# EAGLE design EspSwitchNode (EAGLE 7.2.0)
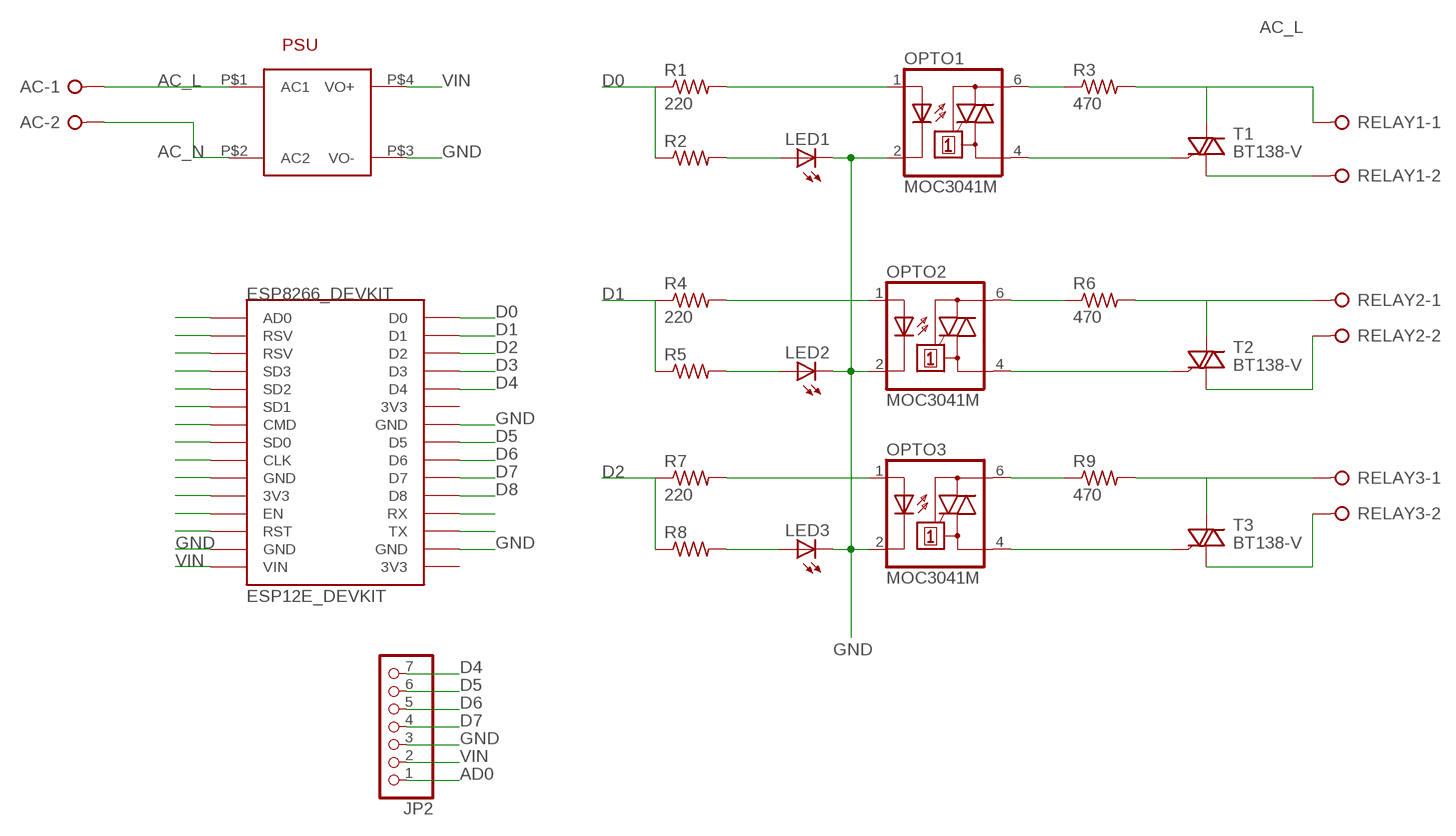
[diagram p0: schematic, sheet 1]

## Parts
AC  W237-02P  [W237-132]
ESP8266_DEVKIT  ESP12E_DEVKIT  [ESP12E_DEVKIT]
JP2  PINHD-1X7  [1X07]
LED1  LEDCHIPLED_0805  [CHIPLED_0805]
LED2  LEDCHIPLED_0805  [CHIPLED_0805]
LED3  LEDCHIPLED_0805  [CHIPLED_0805]
OPTO1  MOC3041M  [DIL06]
OPTO2  MOC3041M  [DIL06]
OPTO3  MOC3041M  [DIL06]
PSU  HLK-PM01  [HLK-PM01]
R1  220  R-US_M0805  [M0805]
R2  R-US_M0805  [M0805]
R3  470  R-US_M0805  [M0805]
R4  220  R-US_M0805  [M0805]
R5  R-US_M0805  [M0805]
R6  470  R-US_M0805  [M0805]
R7  220  R-US_M0805  [M0805]
R8  R-US_M0805  [M0805]
R9  470  R-US_M0805  [M0805]
RELAY1  W237-02P  [W237-132]
RELAY2  W237-02P  [W237-132]
RELAY3  W237-02P  [W237-132]
T1  BT138-V  [TO220BV]
T2  BT138-V  [TO220BV]
T3  BT138-V  [TO220BV]

## Nets
3V3: ESP8266_DEVKIT.3V3@0(3V3)
AC_L: AC.1 PSU.P$1(AC1) R3.2 R6.2 R9.2 RELAY1.1 RELAY2.1 RELAY3.1 T1.T2(A2) T2.T2(A2) T3.T2(A2)
AC_N: AC.2 PSU.P$2(AC2)
AD0: ESP8266_DEVKIT.AD0 JP2.1
CLK: ESP8266_DEVKIT.CLK
CMD: ESP8266_DEVKIT.CMD
D0: ESP8266_DEVKIT.D0 R1.1 R2.1
D1: ESP8266_DEVKIT.D1 R4.1 R5.1
D2: ESP8266_DEVKIT.D2 R7.1 R8.1
D3: ESP8266_DEVKIT.D3
D4: ESP8266_DEVKIT.D4 JP2.7
D5: ESP8266_DEVKIT.D5 JP2.6
D6: ESP8266_DEVKIT.D6 JP2.5
D7: ESP8266_DEVKIT.D7 JP2.4
D8: ESP8266_DEVKIT.D8
EN: ESP8266_DEVKIT.EN
GND: ESP8266_DEVKIT.GND@0(GND) ESP8266_DEVKIT.GND@1(GND) ESP8266_DEVKIT.GND@2(GND) ESP8266_DEVKIT.GND@3(GND) JP2.3 LED1.C LED2.C LED3.C OPTO1.2(C) OPTO2.2(C) OPTO3.2(C) PSU.P$3(VO-)
N$1: OPTO1.1(A) R1.2
N$2: ESP8266_DEVKIT.RSV@0(RSV)
N$3: ESP8266_DEVKIT.RSV@1(RSV)
N$4: OPTO1.6(A2) R3.1
N$6: OPTO2.1(A) R4.2
N$7: LED2.A R5.2
N$9: OPTO2.6(A2) R6.1
N$10: OPTO1.4(A1) T1.G
N$11: OPTO2.4(A1) T2.G
N$12: OPTO3.1(A) R7.2
N$13: LED3.A R8.2
N$14: RELAY2.2 T2.T1(A1)
N$15: OPTO3.6(A2) R9.1
N$16: OPTO3.4(A1) T3.G
N$17: RELAY3.2 T3.T1(A1)
N$18: LED1.A R2.2
N$19: RELAY1.2 T1.T1(A1)
RST: ESP8266_DEVKIT.RST
RX: ESP8266_DEVKIT.RX
SD0: ESP8266_DEVKIT.SD0
SD1: ESP8266_DEVKIT.SD1
SD2: ESP8266_DEVKIT.SD2
SD3: ESP8266_DEVKIT.SD3
TX: ESP8266_DEVKIT.TX
VIN: ESP8266_DEVKIT.VIN JP2.2 PSU.P$4(VO+)
Unconnected: ESP8266_DEVKIT.3V3@1(3V3) ESP8266_DEVKIT.3V3@2(3V3)

## Library data of the parts
AC RELAY1-RELAY3 = con-wago-508:W237-02P: WAGO SREW CLAMP; OC_FARNELL: unknown; OC_NEWARK: unknown
ESP8266_DEVKIT = ESP12E_DEVKIT:ESP12E_DEVKIT: ESP12E DEVKIT BOARD
JP2 = pinhead:PINHD-1X7: PIN HEADER
LED1-LED3 = adafruit:LED: LED OSRAM: - CHIPLED LG R971, LG N971, LY N971, LG Q971, LY Q971, LO R971, LY R971 LH N974, LH R974 LS Q976, LO Q976, LY Q976 LO Q996 - Hyper CHIPLED LW Q18S LB Q993, LB Q99A, LB R99A - SideLED LS A670, LO A670, LY A670, LG A670, LP A670 LB A673, LV A673, LT A673, LW A673 LH A674 LY A675 LS A676, LA A676, LO A676, LY A676, LW A676 LS A679, LY A679, LG A679 - Hyper Micro SIDELED® LS Y876, LA Y876, LO Y876, LY Y876 LT Y87S - SmartLED LW L88C, LW L88S LB L89C, LB L89S, LG L890 LS L89K, LO L89K, LY L89K LS L896, LA L896, LO L896, LY L896 - TOPLED LS T670, LO T670, LY T670, LG T670, LP T670 LSG T670, LSP T670, LSY T670, LOP T670, LYG T670 LG T671, LOG T671, LSG T671 LB T673, LV T673, LT T673, LW T673 LH T674 LS T676, LA T676, LO T676, LY T676, LB T676, LH T676, LSB T676, LW T676 LB T67C, LV T67C, LT T67C, LS T67K, LO T67K, LY T67K, LW E67C LS E67B, LA E67B, LO E67B, LY E67B, LB E67C, LV E67C, LT E67C LW T67C LS T679, LY T679, LG T679 LS T770, LO T770, LY T770, LG T770, LP T770 LB T773, LV T773, LT T773, LW T773 LH T774 LS E675, LA E675, LY E675, LS T675 LS T776, LA T776, LO T776, LY T776, LB T776 LHGB T686 LT T68C, LB T68C - Hyper Mini TOPLED® LB M676 - Mini TOPLED Santana® LG M470 LS M47K, LO M47K, LY M47K Source: http://www.osram.convergy.de/
OPTO1-OPTO3 = optocoupler:MOC30*: 6-Pin DIP Zero-Cross Optoisolators Triac Driver Output (250/400 Volt Peak) Source: Data sheet <http://www.fairchildsemi.com/ds/MO/MOC3031M.pdf> The old path of data sheet not more available 2013-05-06.; MF: FAIRCHILD SEMICONDUCTOR; MPN: MOC3041M; OC_FARNELL: 1086677; OC_NEWARK: 78K6090
PSU = HLK-PM01-Exported:HLK-PM01: HI-LINK Ultra-compact power module HLK-PM01 Meet UL, CE requirements Ultra-thin, ultra-small All voltage input (AC: 90 ~ 264V) Low ripple and low noise Output overload and short circuit protection High efficiency, high power density The product is designed to meet the requirements of EMC and Safety Test Low power consumption, environmental protection, no-load loss <0.1W 100% load aging and testing
R1-R9 = resistor:R-US_: RESISTOR, American symbol
T1-T3 = triac:BT138: TRIAC Source: http://www.semiconductors.philips.com BT138_SERIES_2.pdf

## Board
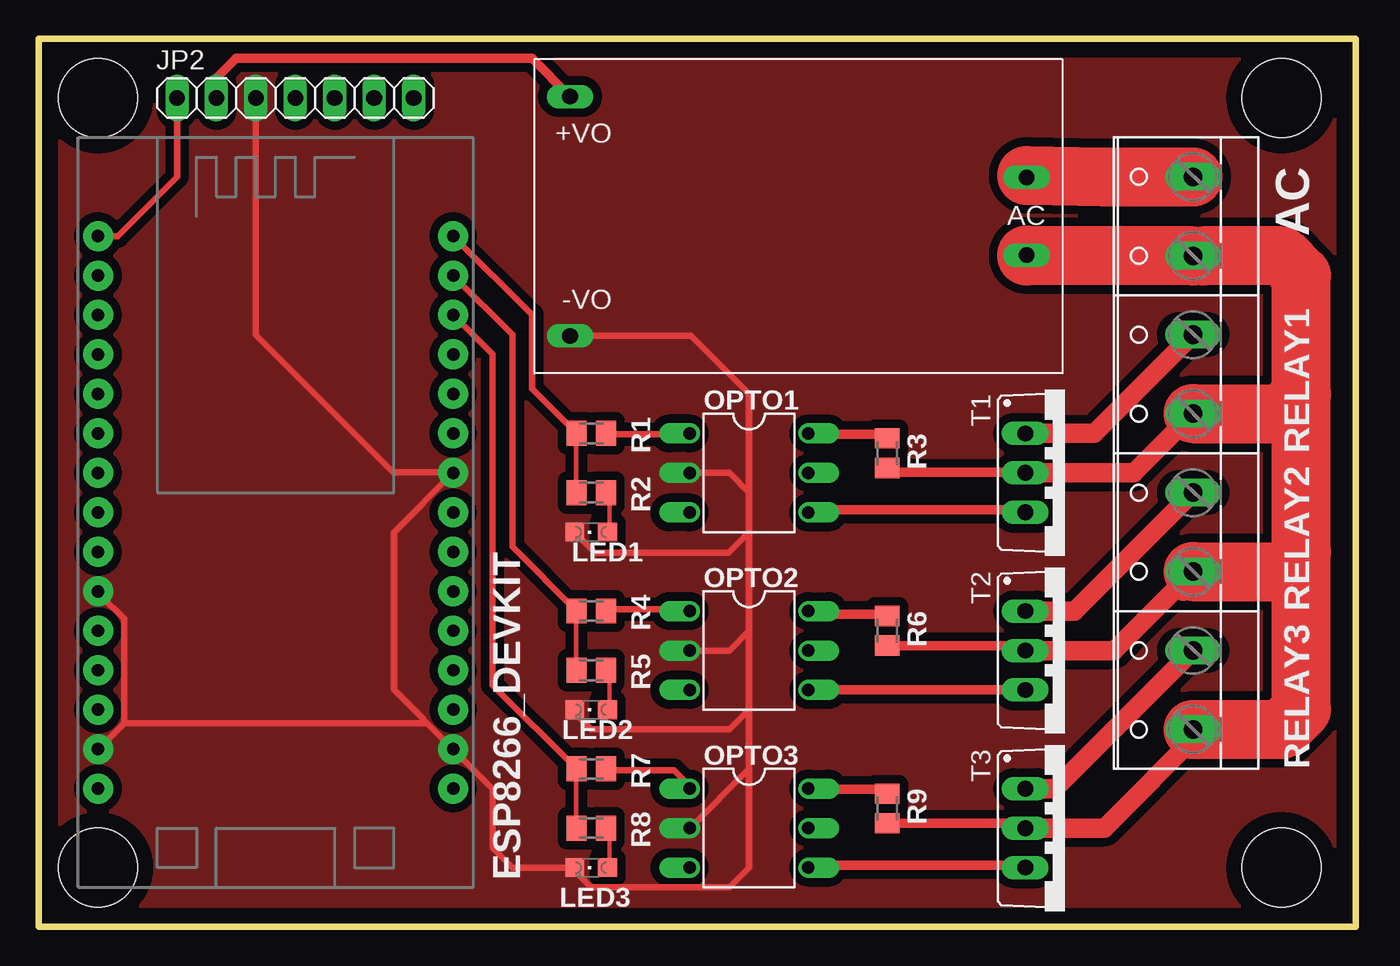
[diagram p1: board, top side]
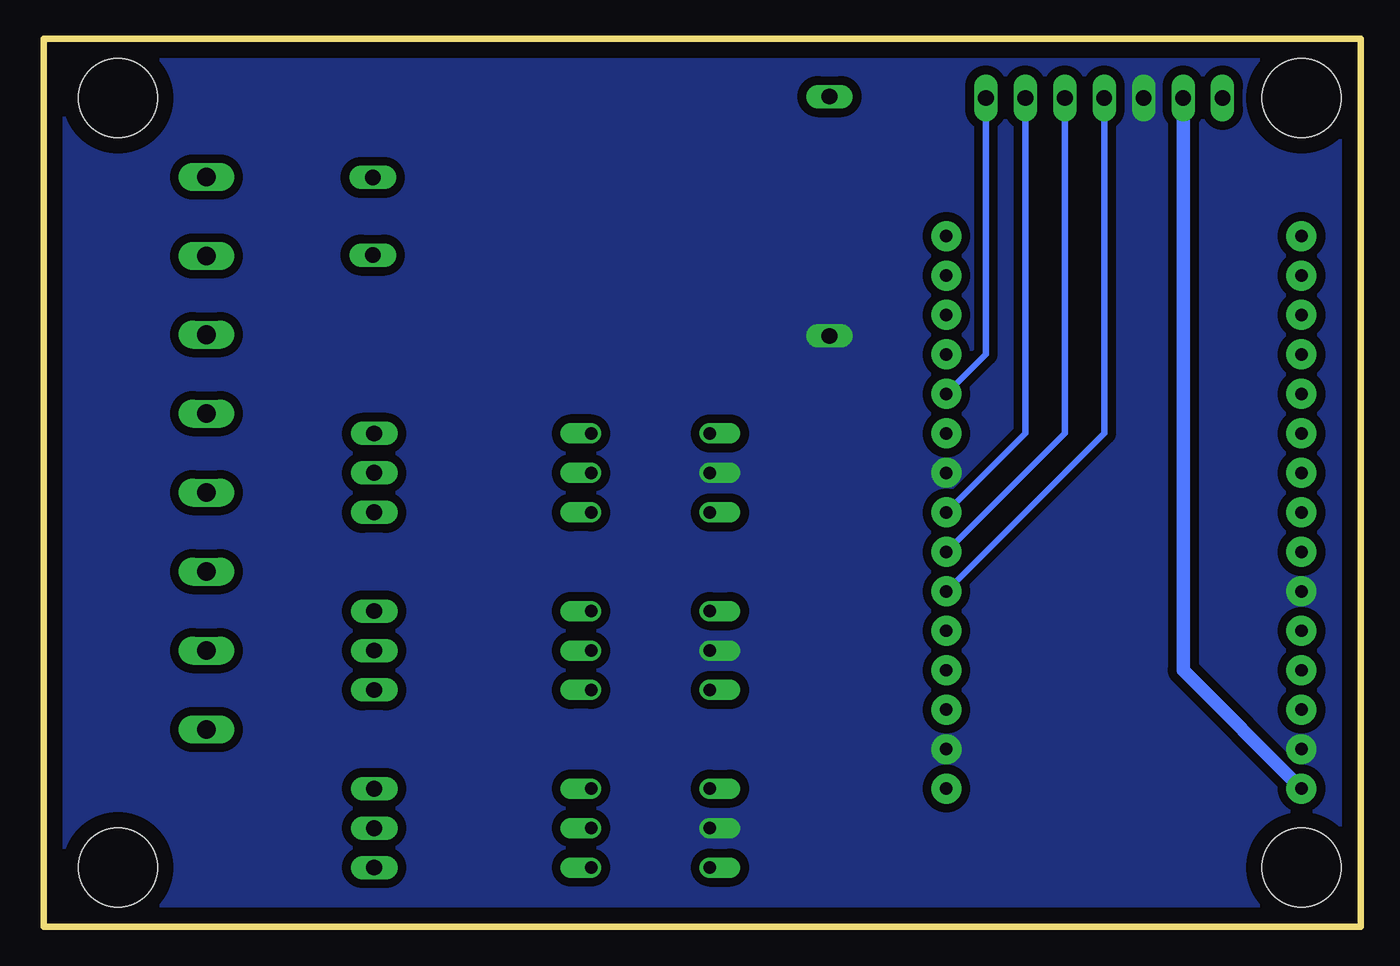
[diagram p2: board, bottom side, seen from below]

Size 84.76 x 57.14 mm. Coordinates in mm from the lower left corner, seen from the top.
Outline: 0,0 84.76,0 84.76,57.14 0,57.14 0,0
Copper layers (1*16): Top 0.035mm / dielectric 1.5mm / Bottom 0.035mm
Design rules "default *": minimum track width 12mil, minimum drill 24mil, track to track 12mil, track to pad 12mil, pad to pad 12mil, via to via 12mil, smd to smd 12mil, copper to edge 40mil, drill to drill 12mil, minimum pad ring 10mil, minimum via ring 8mil, stop-mask expansion 4mil, vias tented up to drill 0mil, thermal gap 10mil
Holes 5.08 mm at 80.01,3.81 80.01,53.34 3.81,53.34 3.81,3.81

### Footprints (pad centres in the part's own frame; a part is rotated, then mirrored left to right if it is on the bottom)
W237-132 = drill 1.194 long: 1 -2.54,-0.635; 2 2.54,-0.635
ESP12E_DEVKIT = drill 0.8 pad 1.93: 3V3@0 -11.43,-7.62; 3V3@1 11.43,5.08; 3V3@2 11.43,-17.78; AD0 -11.43,17.78; CLK -11.43,-2.54; CMD -11.43,2.54; D0 11.43,17.78; D1 11.43,15.24; D2 11.43,12.7; D3 11.43,10.16; D4 11.43,7.62; D5 11.43,0; D6 11.43,-2.54; D7 11.43,-5.08; D8 11.43,-7.62; EN -11.43,-10.16; GND@0 -11.43,-5.08; GND@1 -11.43,-15.24; GND@2 11.43,2.54; GND@3 11.43,-15.24; RST -11.43,-12.7; RSV@0 -11.43,15.24; RSV@1 -11.43,12.7; RX 11.43,-10.16; SD0 -11.43,0; SD1 -11.43,5.08; SD2 -11.43,7.62; SD3 -11.43,10.16; TX 11.43,-12.7; VIN -11.43,-17.78
1X07 = drill 1.016 long: 1 -7.62,0; 2 -5.08,0; 3 -2.54,0; 4 0,0; 5 2.54,0; 6 5.08,0; 7 7.62,0
CHIPLED_0805 = smd 1.2 x 1.2: A 0,-1.05; C 0,1.05
DIL06 = drill 0.813 offset: 1 -2.54,-3.81; 2 0,-3.81; 3 2.54,-3.81; 4 2.54,3.81; 5 0,3.81; 6 -2.54,3.81
HLK-PM01 = drill 1 long: P$1 -14.7,2.5; P$2 -14.7,-2.5; P$3 14.7,7.7; P$4 14.7,-7.7
M0805 = smd 1.3 x 1.6: 1 -0.95,0; 2 0.95,0
TO220BV = drill 1.016 long: G 2.54,-2.54; T1 -2.54,-2.54; T2 0,-2.54

### Placement (x,y rotation side)
AC  73.66,45.72 90 top
ESP8266_DEVKIT  15.24,26.67 0 top
JP2  16.51,53.34 0 top
LED1  35.56,25.4 90 top
LED2  35.56,13.97 90 top
LED3  35.56,3.81 90 top
OPTO1  45.72,29.21 270 top
OPTO2  45.72,17.78 270 top
OPTO3  45.72,6.35 270 top
PSU  48.89,45.72 180 top
R1  35.56,31.75 0 top
R2  35.56,27.94 0 top
R3  54.61,30.48 270 top
R4  35.56,20.32 0 top
R5  35.56,16.51 0 top
R6  54.61,19.05 270 top
R7  35.56,10.16 0 top
R8  35.56,6.35 0 top
R9  54.61,7.62 270 top
RELAY1  73.66,35.56 90 top
RELAY2  73.66,25.4 90 top
RELAY3  73.66,15.24 90 top
T1  66.04,29.21 270 top
T2  66.04,17.78 270 top
T3  66.04,6.35 270 top

### Tracks (layer width: path | path; a pad name or v marks a point on that pad's centre or on a via)
AC_L
  Top 0.305: 54.61,17.98 R6.2 | 74.52,22.71 RELAY2.1 | 54.61,29.26 R3.2 | 54.61,6.4 R9.2
  Top 0.61: 54.61,29.26 63.45,29.26 T1.T2 | R6.2 63.18,18.1 T2.T2 | R9.2 63.18,6.67 T3.T2
  Top 1.27: 80.01,22.86 81.28,24.13 | 73.66,12.06 RELAY3.1 | 73.66,21.59 73.66,22.23 RELAY2.1 69.22,17.78 T2.T2 | T3.T2 68.58,6.35 74.93,12.7 | T1.T2 70.48,29.21 RELAY1.1
  Top 2.54: 74.93,43.18 AC.1
  Top 3.81: RELAY1.1 80.01,33.02 81.28,34.29 | 81.28,34.29 81.28,41.91 80.01,43.18 74.93,43.18 | RELAY2.1 80.01,22.86 | 81.28,34.29 81.28,24.13 81.28,13.97 80.01,12.7 74.93,12.7 RELAY3.1 | AC.1 63.59,43.18 PSU.P$1
AC_N
  Top 0.406: PSU.P$2 63.59,48.36
  Top 3.81: AC.2 68.58,48.26 63.59,48.36
AD0
  Top 0.406: ESP8266_DEVKIT.AD0 5.08,44.45 8.89,48.26 JP2.1
D0
  Top 0.305: R2.1 34.59,28.04 34.59,31.7 R1.1
  Top 0.406: R1.1 31.91,34.45 31.75,34.61 31.75,39.37 ESP8266_DEVKIT.D0
D1
  Top 0.305: R5.1 34.59,16.76 34.59,20.12 R4.1
  Top 0.406: R4.1 30.48,24.45 30.48,38.1 ESP8266_DEVKIT.D1
D2
  Top 0.305: R8.1 34.59,6.4 34.59,10.06 R7.1
  Top 0.406: ESP8266_DEVKIT.D2 29.21,36.83 29.21,15.56 R7.1
D4
  Bottom 0.406: JP2.7 24.13,36.83 ESP8266_DEVKIT.D4
D5
  Bottom 0.406: JP2.6 21.59,31.75 ESP8266_DEVKIT.D5
D6
  Bottom 0.305: 26.52,24.38 ESP8266_DEVKIT.D6
  Bottom 0.406: JP2.5 19.05,31.75 ESP8266_DEVKIT.D6
D7
  Bottom 0.305: 26.52,21.64 ESP8266_DEVKIT.D7
  Bottom 0.406: 26.52,21.64 26.52,21.74 16.51,31.75 JP2.4
GND
  Top 0.305: 26.52,29.26 ESP8266_DEVKIT.GND@2 | 3.96,21.34 ESP8266_DEVKIT.GND@0 | 34.29,13.72 LED2.C | 34.29,25.3 LED1.C | 34.59,3.66 LED3.C | 34.29,25.6 LED1.C | 34.59,25.3 LED1.C
  Top 0.406: 5.49,13.11 ESP8266_DEVKIT.GND@1 | 5.49,13.11 5.49,19.81 3.96,21.34 | 34.59,25.3 35.81,24.08 44.4,24.08 45.72,25.4 | 5.49,13.11 24.99,13.11 ESP8266_DEVKIT.GND@3 | OPTO1.2 44.45,29.21 45.72,27.94 | 45.72,27.94 45.72,25.4 | 45.72,25.4 45.72,19.05 | 45.72,19.05 45.72,13.97 | 45.72,13.97 45.72,10.16 | 45.72,10.16 OPTO3.2 | OPTO2.2 44.45,17.78 45.72,19.05 | 34.59,3.66 34.59,3.5 35.56,2.54 44.45,2.54 45.72,3.81 45.72,10.16 | 26.52,29.26 22.81,29.26 13.97,38.1 JP2.3 | PSU.P$3 41.99,38.02 45.72,34.29 45.72,27.94 | ESP8266_DEVKIT.GND@3 29.21,8.89 29.21,5.08 30.48,3.81 LED3.C | ESP8266_DEVKIT.GND@3 22.86,15.24 22.86,25.4 ESP8266_DEVKIT.GND@2 | 34.29,13.72 34.54,13.72 35.56,12.7 44.45,12.7 45.72,13.97
  pour Bottom (isolate 0.559, no thermals): -3.81,60.96 88.9,60.96 88.9,-2.54 -3.81,-2.54
  pour Top (isolate 0.559, no thermals): -3.81,60.96 88.9,60.96 88.9,-2.54 -3.81,-2.54
N$1
  Top 0.305: 36.73,31.7 R1.2 | 41.81,31.7 OPTO1.1
  Top 0.406: 41.81,31.7 36.73,31.7
N$4
  Top 0.305: 54.61,31.7 R3.1 | 49.73,31.7 OPTO1.6
  Top 0.61: 49.73,31.7 54.61,31.7
N$6
  Top 0.305: 36.73,20.42 R4.2
  Top 0.406: 36.73,20.42 41.81,20.42 OPTO2.1
N$7
  Top 0.305: LED2.A 36.73,14.02 36.73,16.46 R5.2
N$9
  Top 0.305: 54.61,20.12 R6.1
  Top 0.61: 54.61,20.12 49.73,20.12 OPTO2.6
N$10
  Top 0.305: 49.73,26.82 OPTO1.4
  Top 0.61: 49.73,26.82 63.35,26.82 T1.G
N$11
  Top 0.61: OPTO2.4 T2.G
N$12
  Top 0.305: 36.73,10.06 R7.2
  Top 0.406: 36.73,10.06 40.89,10.06 41.81,9.14 OPTO3.1
N$13
  Top 0.305: LED3.A 36.73,3.96 36.73,6.1 R8.2
N$14
  Top 1.27: T2.T1 66.67,20.32 RELAY2.2
N$15
  Top 0.305: 54.61,8.84 R9.1 | 49.73,8.84 OPTO3.6
  Top 0.61: 49.73,8.84 54.61,8.84
N$16
  Top 0.305: 49.73,3.96 OPTO3.4
  Top 0.61: 49.73,3.96 63.35,3.96 T3.G
N$17
  Top 1.27: T3.T1 65.41,8.89 RELAY3.2
N$18
  Top 0.305: LED1.A 36.73,25.6 36.73,27.74 R2.2
N$19
  Top 1.27: 62.86,31.75 T1.T1 67.94,31.75 RELAY1.2
VIN
  Top 0.406: JP2.2 11.43,54.61
  Top 0.61: 11.43,54.61 12.7,55.88 31.74,55.88 PSU.P$4
  Bottom 0.305: 3.96,9.14 ESP8266_DEVKIT.VIN
  Bottom 0.864: JP2.2 11.43,16.51 ESP8266_DEVKIT.VIN